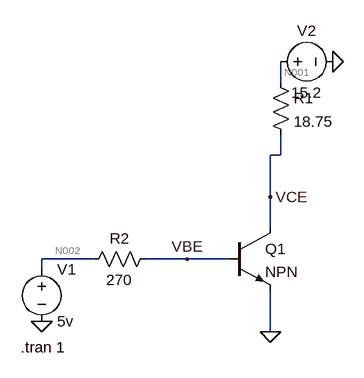
[diagram p0: schematic circuito3.asc]
circuito3.asc, the LTspice schematic file:
Version 4.1
SHEET 1 880 680
WIRE 384 -128 384 -160
WIRE 384 -16 384 -48
WIRE 384 -16 368 -16
WIRE 368 48 368 -16
WIRE 368 96 368 48
WIRE 96 144 16 144
WIRE 240 144 176 144
WIRE 304 144 240 144
WIRE 16 160 16 144
WIRE 368 256 368 192
FLAG 464 -160 0
FLAG 16 240 0
FLAG 368 256 0
FLAG 240 144 VBE
FLAG 368 48 VCE
SYMBOL voltage 16 144 R0
WINDOW 123 0 0 Left 0
WINDOW 39 0 0 Left 0
SYMATTR InstName V1
SYMATTR Value 5v
SYMBOL res 368 -144 R0
SYMATTR InstName R1
SYMATTR Value 18.75
SYMBOL res 192 128 R90
WINDOW 0 0 56 VBottom 2
WINDOW 3 32 56 VTop 2
SYMATTR InstName R2
SYMATTR Value 270
SYMBOL npn 304 96 R0
SYMATTR InstName Q1
SYMBOL voltage 368 -160 R270
WINDOW 0 32 56 VTop 2
WINDOW 3 -32 56 VBottom 2
WINDOW 123 0 0 Left 0
WINDOW 39 0 0 Left 0
SYMATTR InstName V2
SYMATTR Value 15.2
TEXT -16 280 Left 2 !.tran 1

The netlist it stands for:
* circuito3.asc
V1 N002 0 5v
R1 N001 VCE 18.75
R2 VBE N002 270
Q1 VCE VBE 0 0 NPN
V2 N001 0 15.2
.model NPN NPN
.model PNP PNP
.lib standard.bjt
.tran 1
.backanno
.end

* Results of the author's LTspice run, read from the files saved beside the schematic
* Operating Point, zero values left out:
*   V(n001) = 15.2 V
*   V(vbe) = 947.7 mV
*   V(n002) = 5 V
*   V(vce) = 123.8 mV
*   I(V1) = -15.01 mA
*   I(R2) = -15.01 mA
*   I(V2) = -804.1 mA
*   Ic(Q1) = 804.1 mA
*   Ib(Q1) = 15.01 mA
*   Ie(Q1) = -819.1 mA
*   I(R1) = 804.1 mA
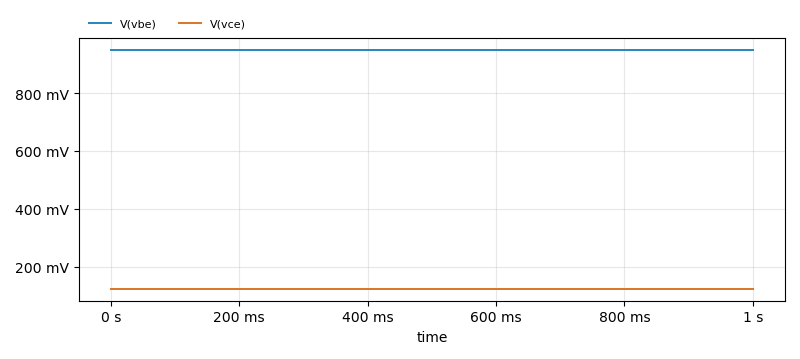
[diagram p1: Transient Analysis of circuito3.asc, plotted from the saved traces]
* Transient Analysis, 1 run:
*   V(vbe): min 947.7 mV, max 947.7 mV, average 947.7 mV, rms 947.7 mV, last 947.7 mV
*   V(vce): min 123.8 mV, max 123.8 mV, average 123.8 mV, rms 123.8 mV, last 123.8 mV